# Altium schematic sheet Interconnections.SchDoc
size A3; SheetNumber: 1; SheetTotal: 16
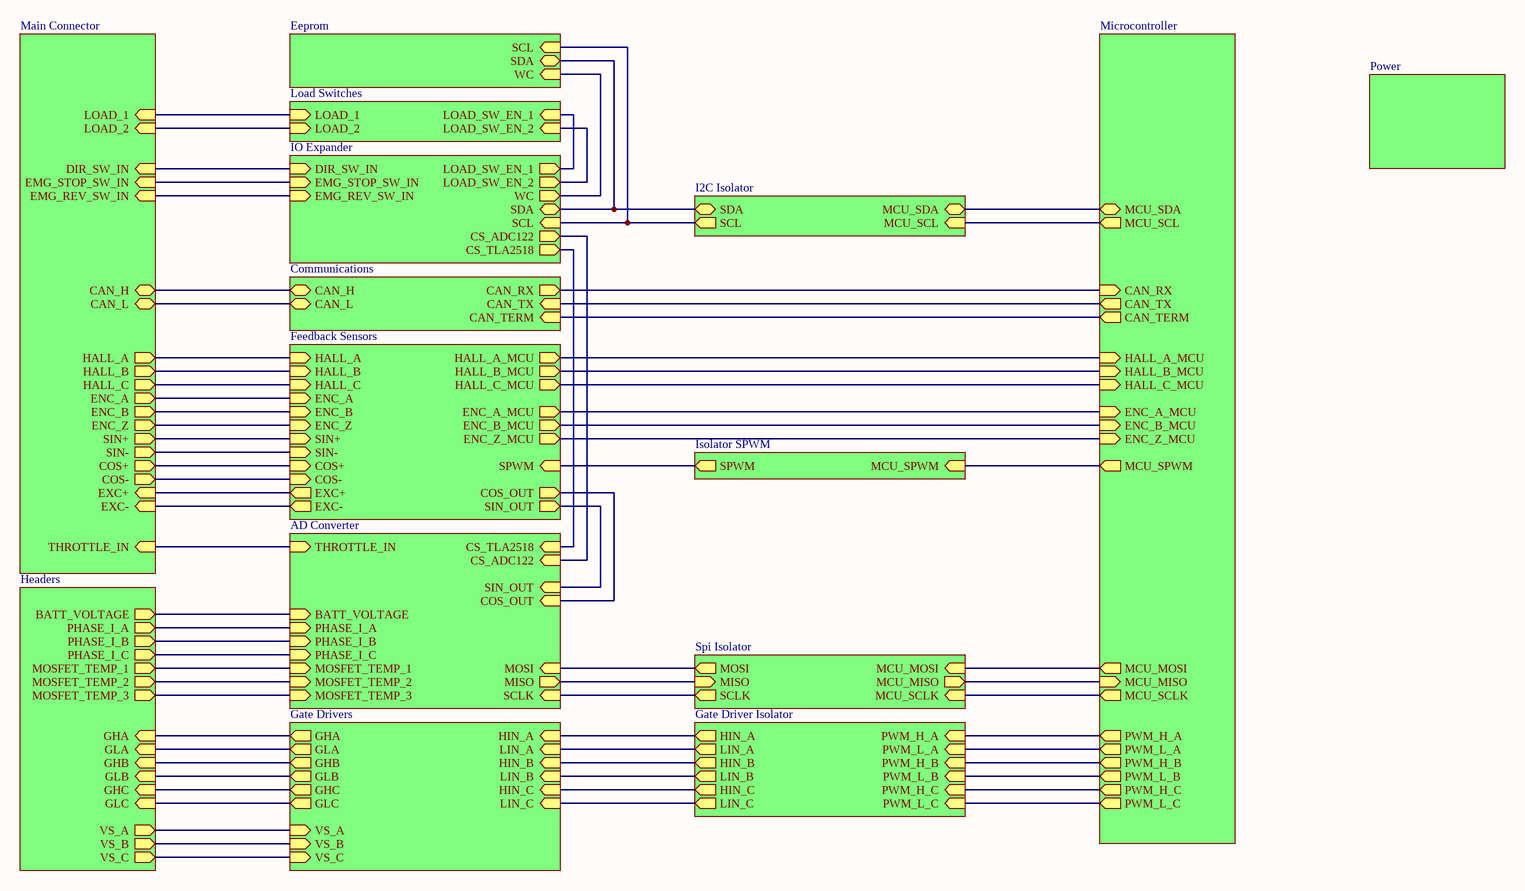
[diagram p0: Interconnections.SchDoc]

## Sub-sheets
AD Converter = AD_Converter.SchDoc: CS_TLA2518 (in), BATT_VOLTAGE (in), PHASE_I_A (in), PHASE_I_C (in), MOSFET_TEMP_1 (in), MOSFET_TEMP_2 (in), MOSFET_TEMP_3 (in), SIN_OUT (in), COS_OUT (in), CS_ADC122 (in), THROTTLE_IN (in), PHASE_I_B (in), SCLK (in), MISO (out), MOSI (in)
Communications = Communications.SchDoc: CAN_RX (out), CAN_TX (in), CAN_H (bidir), CAN_L (bidir), CAN_TERM (in)
Eeprom = Eeprom.SchDoc: SCL (in), SDA (bidir), WC (in)
Feedback Sensors = Feedback_Sensors.SchDoc: EXC- (out), SPWM (in), EXC+ (out), SIN+ (in), SIN- (in), SIN_OUT (out), COS+ (in), COS- (in), HALL_A (in), HALL_B (in), HALL_C (in), HALL_A_MCU (out), HALL_B_MCU (out), HALL_C_MCU (out), ENC_A (in), ENC_B (in), ENC_A_MCU (out), ENC_B_MCU (out), ENC_Z_MCU (out), ENC_Z (in), COS_OUT (out)
Gate Driver Isolator = Isolator_Gate_Driver.SchDoc: PWM_H_A (in), PWM_L_A (in), PWM_H_B (in), PWM_L_B (in), PWM_H_C (in), PWM_L_C (in), HIN_A (out), LIN_A (out), HIN_B (out), LIN_B (out), HIN_C (out), LIN_C (out)
Gate Drivers = Gate_Drivers.SchDoc: GHA (out), GLA (out), VS_A (in), HIN_A (in), LIN_A (in), GHB (out), GLB (out), VS_B (in), HIN_B (in), LIN_B (in), GHC (out), GLC (out), VS_C (in), HIN_C (in), LIN_C (in)
Headers = Headers.SchDoc: MOSFET_TEMP_3 (out), MOSFET_TEMP_1 (out), PHASE_I_C (out), PHASE_I_A (out), BATT_VOLTAGE (out), MOSFET_TEMP_2 (out), VS_A (out), VS_B (out), VS_C (out), GHA (in), GLA (in), GHB (in), GLB (in), GHC (in), GLC (in), PHASE_I_B (out)
I2C Isolator = Isolator_I2C.SchDoc: MCU_SDA (bidir), MCU_SCL (in), SDA (bidir), SCL (out)
IO Expander = IO_Expander.SchDoc: LOAD_SW_EN_1 (out), LOAD_SW_EN_2 (out), CS_TLA2518 (out), DIR_SW_IN (in), EMG_STOP_SW_IN (in), EMG_REV_SW_IN (in), CS_ADC122 (out), WC (out), SDA (bidir), SCL (in)
Isolator SPWM = Isolator_SPWM.SchDoc: MCU_SPWM (in), SPWM (out)
Load Switches = Load_Switches.SchDoc: LOAD_SW_EN_1 (in), LOAD_1 (in), LOAD_SW_EN_2 (in), LOAD_2 (in)
Main Connector = Main_Connector.SchDoc: LOAD_1 (in), LOAD_2 (in), DIR_SW_IN (in), EMG_STOP_SW_IN (in), EMG_REV_SW_IN (in), THROTTLE_IN (in), CAN_H (bidir), CAN_L (bidir), EXC+ (in), HALL_A (out), HALL_B (out), HALL_C (out), ENC_A (out), ENC_B (out), ENC_Z (out), SIN+ (out), SIN- (out), COS+ (out), COS- (out), EXC- (in)
Microcontroller = Microcontroller.SchDoc: ENC_Z_MCU (in), ENC_B_MCU (in), ENC_A_MCU (in), HALL_C_MCU (in), HALL_B_MCU (in), HALL_A_MCU (in), CAN_TERM (out), CAN_TX (out), CAN_RX (in), MCU_MOSI (out), MCU_MISO (in), MCU_SCLK (out), PWM_H_A (out), PWM_L_A (out), PWM_L_B (out), PWM_L_C (out), PWM_H_B (out), PWM_H_C (out), MCU_SDA (bidir), MCU_SCL (out), MCU_SPWM (out)
Power = Power.SchDoc: no entries
Spi Isolator = Isolator_Spi.SchDoc: MCU_SCLK (in), MCU_MOSI (in), MCU_MISO (out), SCLK (out), MOSI (out), MISO (in)

## Nets
(unnamed): sheet Eeprom/SCL, sheet IO Expander/SCL, sheet I2C Isolator/SCL
(unnamed): sheet Eeprom/SDA, sheet IO Expander/SDA, sheet I2C Isolator/SDA
(unnamed): sheet Eeprom/WC, sheet IO Expander/WC
(unnamed): sheet Load Switches/LOAD_SW_EN_1, sheet IO Expander/LOAD_SW_EN_1
(unnamed): sheet Load Switches/LOAD_1, sheet Main Connector/LOAD_1
(unnamed): sheet Load Switches/LOAD_SW_EN_2, sheet IO Expander/LOAD_SW_EN_2
(unnamed): sheet Load Switches/LOAD_2, sheet Main Connector/LOAD_2
(unnamed): sheet IO Expander/CS_TLA2518, sheet AD Converter/CS_TLA2518
(unnamed): sheet IO Expander/DIR_SW_IN, sheet Main Connector/DIR_SW_IN
(unnamed): sheet IO Expander/EMG_STOP_SW_IN, sheet Main Connector/EMG_STOP_SW_IN
(unnamed): sheet IO Expander/EMG_REV_SW_IN, sheet Main Connector/EMG_REV_SW_IN
(unnamed): sheet IO Expander/CS_ADC122, sheet AD Converter/CS_ADC122
(unnamed): sheet Communications/CAN_RX, sheet Microcontroller/CAN_RX
(unnamed): sheet Communications/CAN_TX, sheet Microcontroller/CAN_TX
(unnamed): sheet Communications/CAN_H, sheet Main Connector/CAN_H
(unnamed): sheet Communications/CAN_L, sheet Main Connector/CAN_L
(unnamed): sheet Communications/CAN_TERM, sheet Microcontroller/CAN_TERM
(unnamed): sheet Feedback Sensors/EXC-, sheet Main Connector/EXC-
(unnamed): sheet Feedback Sensors/SPWM, sheet Isolator SPWM/SPWM
(unnamed): sheet Feedback Sensors/EXC+, sheet Main Connector/EXC+
(unnamed): sheet Feedback Sensors/SIN+, sheet Main Connector/SIN+
(unnamed): sheet Feedback Sensors/SIN-, sheet Main Connector/SIN-
(unnamed): sheet Feedback Sensors/SIN_OUT, sheet AD Converter/SIN_OUT
(unnamed): sheet Feedback Sensors/COS+, sheet Main Connector/COS+
(unnamed): sheet Feedback Sensors/COS-, sheet Main Connector/COS-
(unnamed): sheet Feedback Sensors/HALL_A, sheet Main Connector/HALL_A
(unnamed): sheet Feedback Sensors/HALL_B, sheet Main Connector/HALL_B
(unnamed): sheet Feedback Sensors/HALL_C, sheet Main Connector/HALL_C
(unnamed): sheet Feedback Sensors/HALL_A_MCU, sheet Microcontroller/HALL_A_MCU
(unnamed): sheet Feedback Sensors/HALL_B_MCU, sheet Microcontroller/HALL_B_MCU
(unnamed): sheet Feedback Sensors/HALL_C_MCU, sheet Microcontroller/HALL_C_MCU
(unnamed): sheet Feedback Sensors/ENC_A, sheet Main Connector/ENC_A
(unnamed): sheet Feedback Sensors/ENC_B, sheet Main Connector/ENC_B
(unnamed): sheet Feedback Sensors/ENC_A_MCU, sheet Microcontroller/ENC_A_MCU
(unnamed): sheet Feedback Sensors/ENC_B_MCU, sheet Microcontroller/ENC_B_MCU
(unnamed): sheet Feedback Sensors/ENC_Z_MCU, sheet Microcontroller/ENC_Z_MCU
(unnamed): sheet Feedback Sensors/ENC_Z, sheet Main Connector/ENC_Z
(unnamed): sheet Feedback Sensors/COS_OUT, sheet AD Converter/COS_OUT
(unnamed): sheet AD Converter/BATT_VOLTAGE, sheet Headers/BATT_VOLTAGE
(unnamed): sheet AD Converter/PHASE_I_A, sheet Headers/PHASE_I_A
(unnamed): sheet AD Converter/PHASE_I_C, sheet Headers/PHASE_I_C
(unnamed): sheet AD Converter/MOSFET_TEMP_1, sheet Headers/MOSFET_TEMP_1
(unnamed): sheet AD Converter/MOSFET_TEMP_2, sheet Headers/MOSFET_TEMP_2
(unnamed): sheet AD Converter/MOSFET_TEMP_3, sheet Headers/MOSFET_TEMP_3
(unnamed): sheet AD Converter/THROTTLE_IN, sheet Main Connector/THROTTLE_IN
(unnamed): sheet AD Converter/PHASE_I_B, sheet Headers/PHASE_I_B
(unnamed): sheet AD Converter/SCLK, sheet Spi Isolator/SCLK
(unnamed): sheet AD Converter/MISO, sheet Spi Isolator/MISO
(unnamed): sheet AD Converter/MOSI, sheet Spi Isolator/MOSI
(unnamed): sheet Gate Drivers/GHA, sheet Headers/GHA
(unnamed): sheet Gate Drivers/GLA, sheet Headers/GLA
(unnamed): sheet Gate Drivers/VS_A, sheet Headers/VS_A
(unnamed): sheet Gate Drivers/HIN_A, sheet Gate Driver Isolator/HIN_A
(unnamed): sheet Gate Drivers/LIN_A, sheet Gate Driver Isolator/LIN_A
(unnamed): sheet Gate Drivers/GHB, sheet Headers/GHB
(unnamed): sheet Gate Drivers/GLB, sheet Headers/GLB
(unnamed): sheet Gate Drivers/VS_B, sheet Headers/VS_B
(unnamed): sheet Gate Drivers/HIN_B, sheet Gate Driver Isolator/HIN_B
(unnamed): sheet Gate Drivers/LIN_B, sheet Gate Driver Isolator/LIN_B
(unnamed): sheet Gate Drivers/GHC, sheet Headers/GHC
(unnamed): sheet Gate Drivers/GLC, sheet Headers/GLC
(unnamed): sheet Gate Drivers/VS_C, sheet Headers/VS_C
(unnamed): sheet Gate Drivers/HIN_C, sheet Gate Driver Isolator/HIN_C
(unnamed): sheet Gate Drivers/LIN_C, sheet Gate Driver Isolator/LIN_C
(unnamed): sheet Gate Driver Isolator/PWM_H_A, sheet Microcontroller/PWM_H_A
(unnamed): sheet Gate Driver Isolator/PWM_L_A, sheet Microcontroller/PWM_L_A
(unnamed): sheet Gate Driver Isolator/PWM_H_B, sheet Microcontroller/PWM_H_B
(unnamed): sheet Gate Driver Isolator/PWM_L_B, sheet Microcontroller/PWM_L_B
(unnamed): sheet Gate Driver Isolator/PWM_H_C, sheet Microcontroller/PWM_H_C
(unnamed): sheet Gate Driver Isolator/PWM_L_C, sheet Microcontroller/PWM_L_C
(unnamed): sheet Microcontroller/MCU_MOSI, sheet Spi Isolator/MCU_MOSI
(unnamed): sheet Microcontroller/MCU_MISO, sheet Spi Isolator/MCU_MISO
(unnamed): sheet Microcontroller/MCU_SCLK, sheet Spi Isolator/MCU_SCLK
(unnamed): sheet Microcontroller/MCU_SDA, sheet I2C Isolator/MCU_SDA
(unnamed): sheet Microcontroller/MCU_SCL, sheet I2C Isolator/MCU_SCL
(unnamed): sheet Microcontroller/MCU_SPWM, sheet Isolator SPWM/MCU_SPWM